# Altium project Simple project.PrjPcb
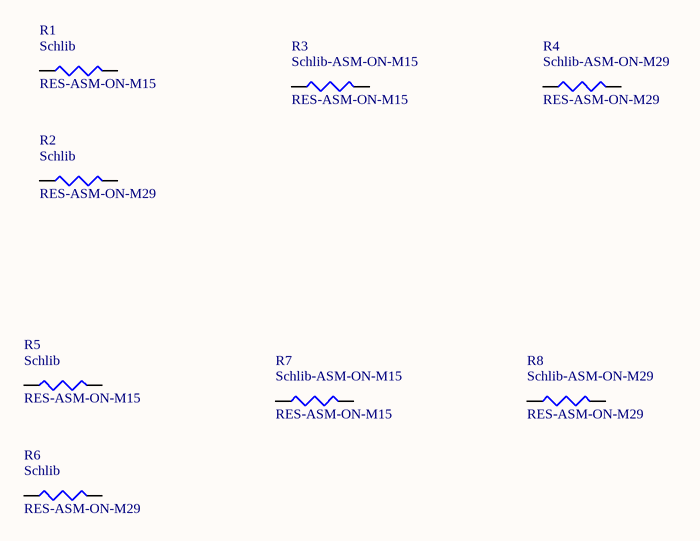
[diagram p0: Schematic.SchDoc]
1 sheet, 8 parts. Net scope: global (net labels, ports and power ports of the same name join across sheets).
Board file: PCB.PcbDoc

## Sheet Schematic.SchDoc
size A

### Parts
R1  RES-ASM-ON-M15  [R0805-ASM-ON-M15]
R2  RES-ASM-ON-M29  [R0805-ASM-ON-M29]
R3  RES-ASM-ON-M15  [R0805-ASM-ON-M15]
R4  RES-ASM-ON-M29  [R0805-ASM-ON-M29]
R5  RES-ASM-ON-M15  [R0805-ASM-ON-M15]
R6  RES-ASM-ON-M29  [R0805-ASM-ON-M29]
R7  RES-ASM-ON-M15  [R0805-ASM-ON-M15]
R8  RES-ASM-ON-M29  [R0805-ASM-ON-M29]

### Nets

Not connected (* = marked no-connect by the designer): R1 1 2; R2 1 2; R3 1 2; R4 1 2; R5 1 2; R6 1 2; R7 1 2; R8 1 2

### Notes on the sheet
- (in symbol RES-ASM-ON-M15) Schlib-ASM-ON-M15; Schlib
- (in symbol RES-ASM-ON-M29) Schlib-ASM-ON-M29; Schlib

### Library data of the parts
R1 R3 R5 R7 = RES-ASM-ON-M15: ASM ON M15
R2 R4 R6 R8 = RES-ASM-ON-M29: ASM ON M29